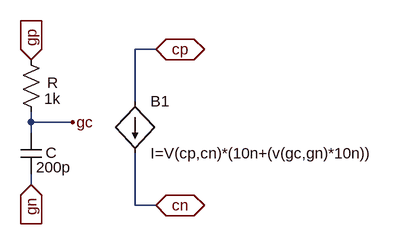
[diagram p0: schematic Capteur_Graphite.asc]
Capteur_Graphite.asc, the LTspice schematic file:
Version 4
SHEET 1 880 680
WIRE 304 -32 272 -32
WIRE 272 48 272 -32
WIRE 112 80 112 64
WIRE 176 80 112 80
WIRE 112 96 112 80
WIRE 112 176 112 160
WIRE 272 208 272 128
WIRE 304 208 272 208
FLAG 112 -16 gp
IOPIN 112 -16 In
FLAG 112 176 gn
IOPIN 112 176 In
FLAG 176 80 gc
FLAG 304 -32 cp
IOPIN 304 -32 BiDir
FLAG 304 208 cn
IOPIN 304 208 BiDir
SYMBOL res 96 -32 R0
WINDOW 0 41 51 Left 2
SYMATTR InstName R
SYMATTR Value 1k
SYMBOL cap 96 96 R0
WINDOW 0 38 31 Left 2
WINDOW 3 24 53 Left 2
SYMATTR InstName C
SYMATTR Value 200p
SYMBOL bi 272 48 R0
SYMATTR InstName B1
SYMATTR Value I=V(cp,cn)*(10n+(v(gc,gn)*10n))

The netlist it stands for:
* Capteur_Graphite.asc
R gp gc 1k
C gc gn 200p
B1 cp cn I=V(cp,cn)*(10n+(v(gc,gn)*10n))
.backanno
.end